# Altium schematic sheet powerswitch.SchDoc
size C
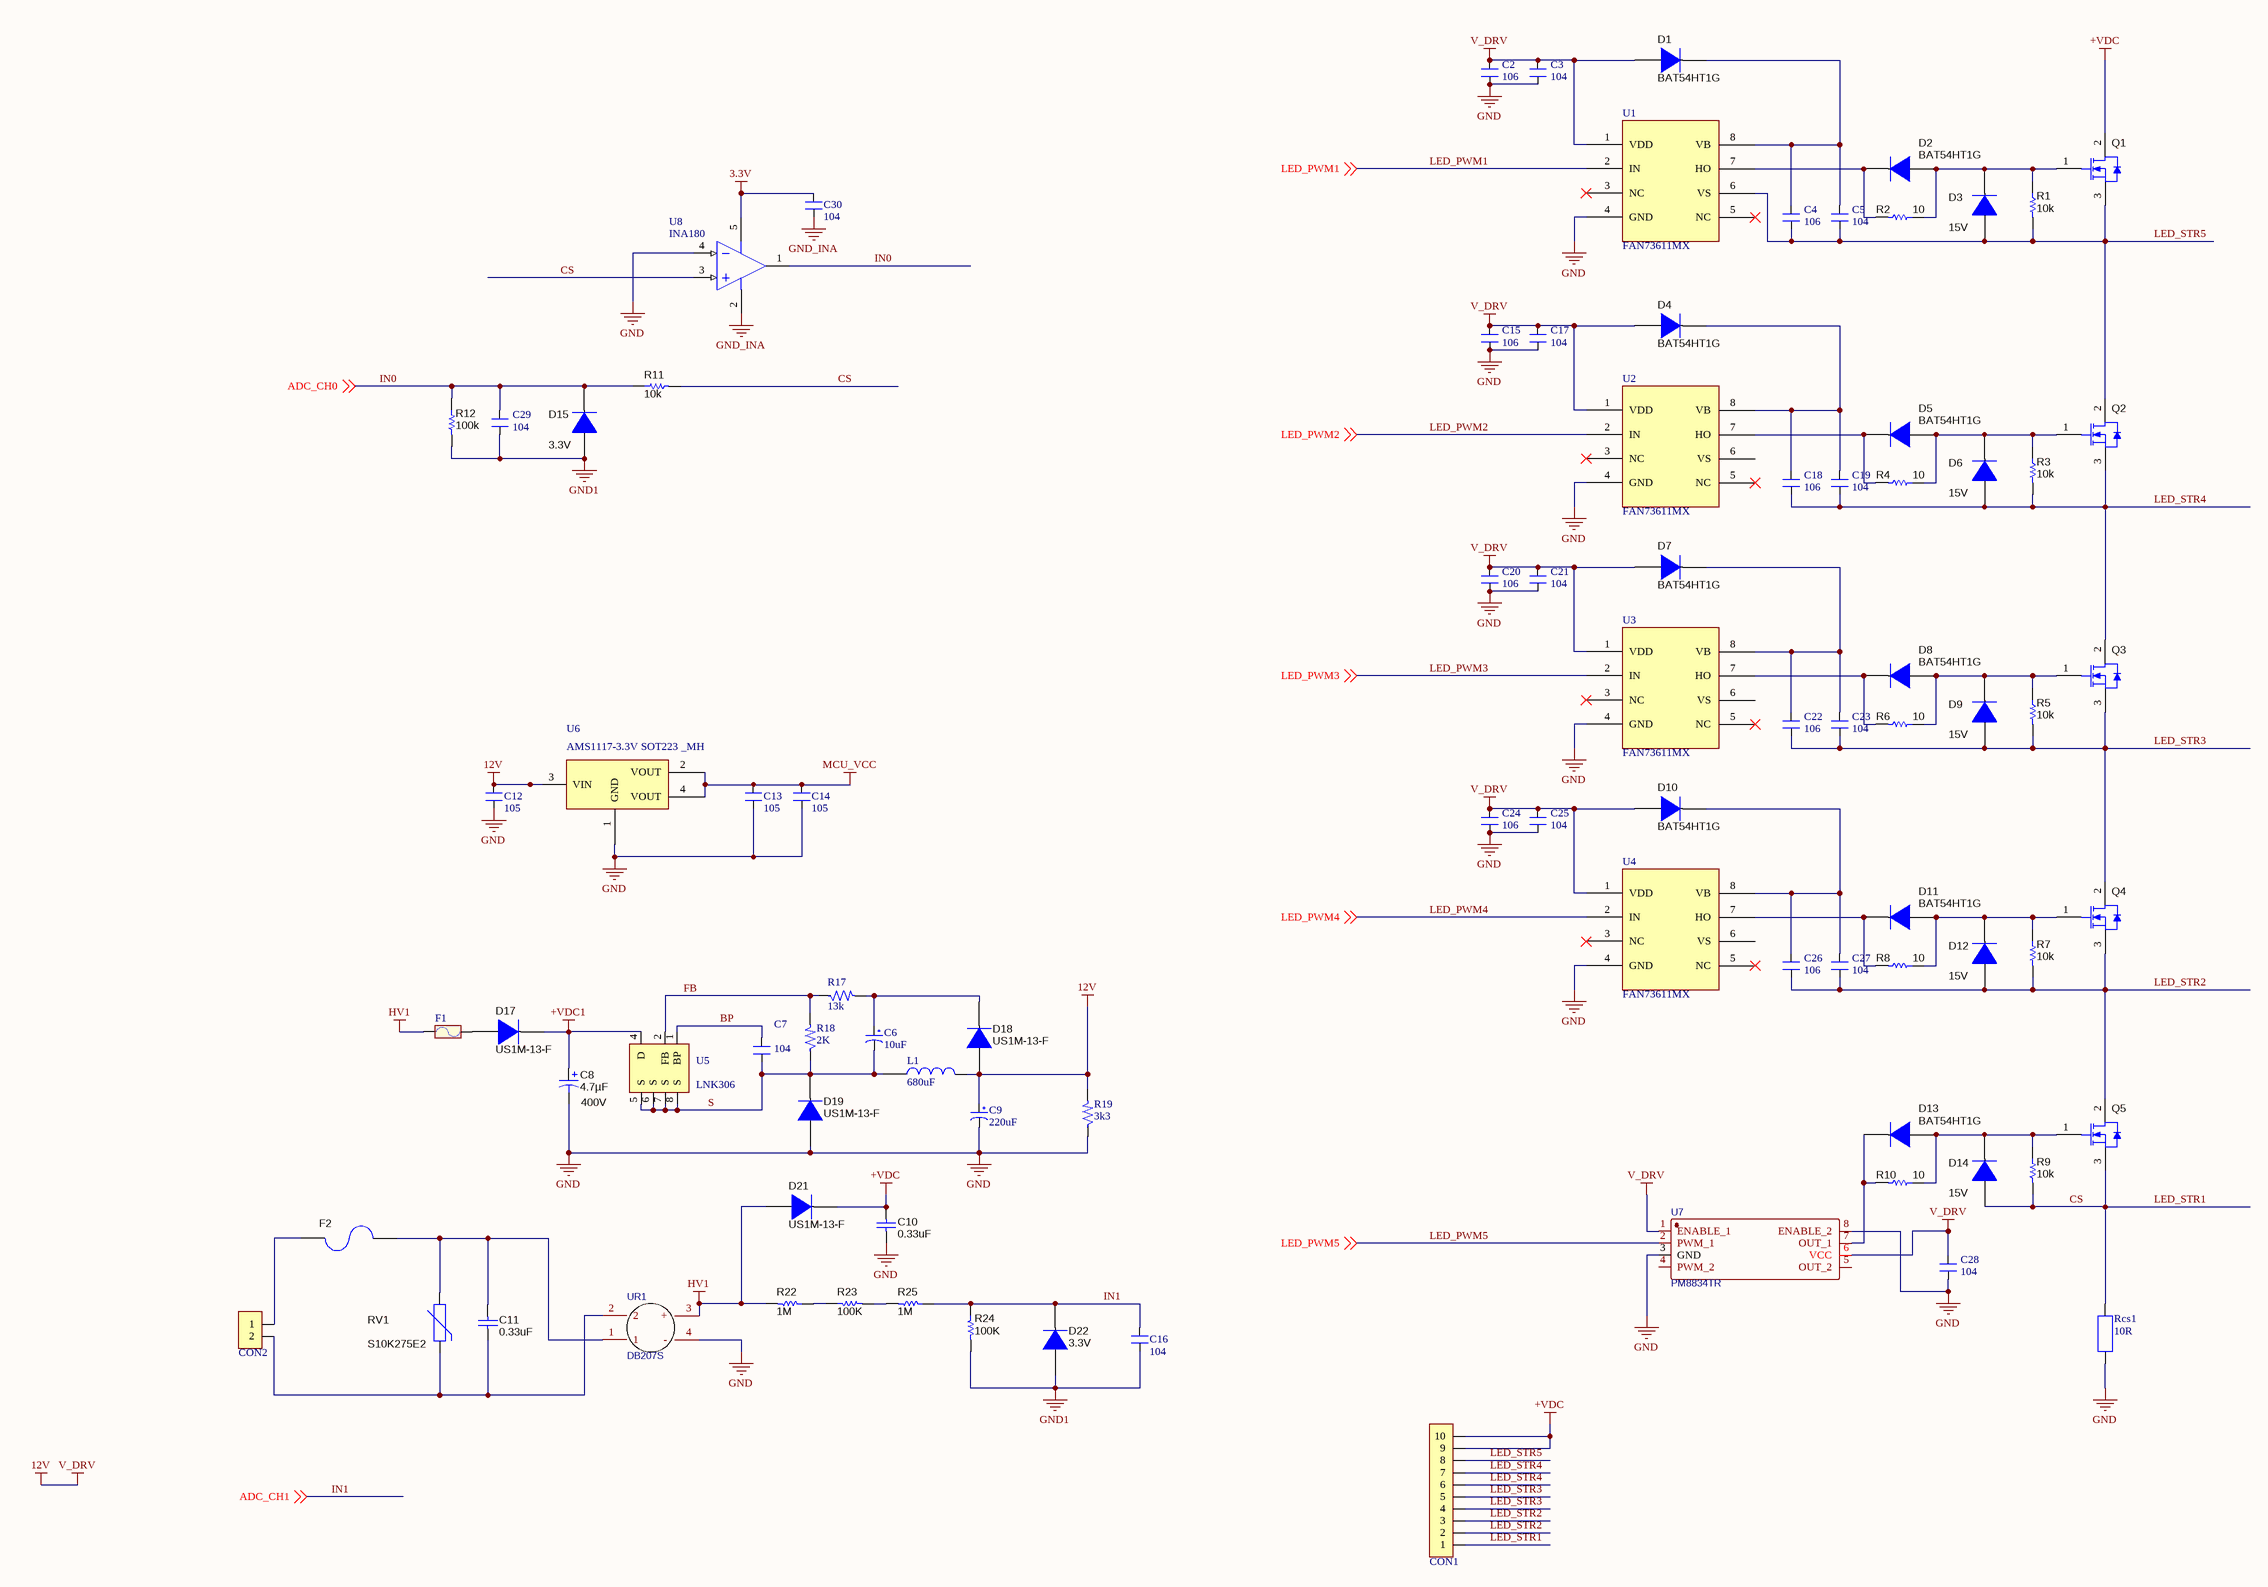
[diagram p0: powerswitch.SchDoc]

## Parts
C2  106  [0805_HV]
C3  104  [0805_HV]
C4  106  [0805_HV]
C5  104  [0805_HV]
C6  10uF  [TU_NHOM_10uF_MH]
C7  104  [0805_HV]
C8  ValueDisplayed: 4.7µF  Value2: 400V  [CAP-PANACAP-G-GENERIC]  (hidden comment: 400AX6R8M8x11)
C9  220uF  [TU_NHOM_2.5_MH]
C10  value 0.33uF  [B32922_12mm]  (hidden comment: B32922C3334M189)
C11  value 0.33uF  [B32922_12mm]  (hidden comment: B32922C3334M189)
C12  105  [0805_HV]
C13  105  [0805_HV]
C14  105  [0805_HV]
C15  106  [0805_HV]
C16  104  [0805_HV]
C17  104  [0805_HV]
C18  106  [0805_HV]
C19  104  [0805_HV]
C20  106  [0805_HV]
C21  104  [0805_HV]
C22  106  [0805_HV]
C23  104  [0805_HV]
C24  106  [0805_HV]
C25  104  [0805_HV]
C26  106  [0805_HV]
C27  104  [0805_HV]
C28  104  [0805_HV]
C29  104  [0805_HV]
C30  104  [0805_HV]
CON1  CON 10 EDG 5.08_MH  [Con 10 EDG 5.08]  (value not drawn)
CON2  CON 2 EDG 5.08_MH  [CON 2 EDG 5.08]  (value not drawn)
D1  BAT54HT1G  [SOD-323]
D2  BAT54HT1G  [SOD-323]
D3  15V  [SOD-323]
D4  BAT54HT1G  [SOD-323]
D5  BAT54HT1G  [SOD-323]
D6  15V  [SOD-323]
D7  BAT54HT1G  [SOD-323]
D8  BAT54HT1G  [SOD-323]
D9  15V  [SOD-323]
D10  BAT54HT1G  [SOD-323]
D11  BAT54HT1G  [SOD-323]
D12  15V  [SOD-323]
D13  BAT54HT1G  [SOD-323]
D14  15V  [SOD-323]
D15  3.3V  [SOD-323]
D17  US1M-13-F  [SMB]
D18  US1M-13-F  [SMB]
D19  US1M-13-F  [SMB]
D21  US1M-13-F  [SMB]
D22  3.3V  [SOD-323]
F1  FUSE_AUTO_0.5A 8V 1206_MH  [FUSE 1206]  (value not drawn)
F2  37015000430  [Fuse 5x20]  (value not drawn)
L1  680uF  [Inductor 4.5x5]
Q1  IPA60R330P  [TO-220AB_NH]  (value not drawn)
Q2  IPA60R330P  [TO-220AB_NH]  (value not drawn)
Q3  IPA60R330P  [TO-220AB_NH]  (value not drawn)
Q4  IPA60R330P  [TO-220AB_NH]  (value not drawn)
Q5  IPA60R330P  [TO-220AB_NH]  (value not drawn)
R1  10k  [Tro SMD 0805]
R2  10  [Tro SMD 0805]
R3  10k  [Tro SMD 0805]
R4  10  [Tro SMD 0805]
R5  10k  [Tro SMD 0805]
R6  10  [Tro SMD 0805]
R7  10k  [Tro SMD 0805]
R8  10  [Tro SMD 0805]
R9  10k  [Tro SMD 0805]
R10  10  [Tro SMD 0805]
R11  10k  [Tro SMD 0805]
R12  100k  [Tro SMD 0805]
R17  13k  [0805_HV]
R18  2K  [0805_HV]
R19  3k3  [0805_HV]
R22  1M  [1206]
R23  100K  [1206]
R24  100K  [1206]
R25  1M  [1206]
Rcs1  10R  [TRO_VACH_2W]
RV1  S10K275E2  [VAR_S10K275E2]
U1  FAN73611MX  [SOP 8]
U2  FAN73611MX  [SOP 8]
U3  FAN73611MX  [SOP 8]
U4  FAN73611MX  [SOP 8]
U5  LNK306  [SOP 7]
U6  AMS1117-3.3V SOT223 _MH  [SOT223]
U7  PM8834TR  [SOP 8]
U8  INA180  [SOT23-5AL]
UR1  DB207S  [DB207S]

## Nets
3.3V: C30.2 U8.5(V+)
12V: C2.2 C3.2 C9.1 C12.2 C15.2 C17.2 C20.2 C21.2 C24.2 C25.2 C28.2 D1.2(A) D4.2(A) D7.2(A) D10.2(A) D18.2(A) L1.2 R19.2 U1.1(VDD) U2.1(VDD) U3.1(VDD) U4.1(VDD) U6.3(VIN) U7.1(ENABLE_1) U7.6(VCC)  [also labelled V_DRV]
+VDC: C10.2 CON1.9 CON1.10 D21.1(K) Q1.2(D)
+VDC1: C8.1(+) D17.1(K) U5.4(D)
GND: C2.1 C3.1 C8.2(-) C9.2 C10.1 C12.1 C13.1 C14.1 C15.1 C17.1 C20.1 C21.1 C24.1 C25.1 C28.1 D19.2(A) R19.1 Rcs1.1 U1.4(GND) U2.4(GND) U3.4(GND) U4.4(GND) U6.1(GND) U7.3(GND) U7.8(ENABLE_2) U8.4(IN-) UR1.4(-)
GND1: C16.1 C29.1 D15.2(A) D22.2(A) R12.2 R24.2
GND_INA: C30.1 U8.2(V-)
HV1: D21.2(A) F1.1 R22.2 UR1.3(+)
MCU_VCC: C13.2 C14.2 U6.2(VOUT) U6.4(VOUT)
BP: C7.2 U5.1(BP)
CS: CON1.1 D14.2(A) Q5.3(S) R9.2 R11.2 Rcs1.2 U8.3(IN+)  [also labelled LED_STR1]
FB: R17.1 R18.2 U5.2(FB)
IN0: C29.2 D15.1(K) R11.1 R12.1 U8.1(OUT) ; off-sheet ADC_CH0  [also labelled ADC_CH0]
IN1: C16.2 D22.1(K) R24.1 R25.1 ; off-sheet ADC_CH1  [also labelled ADC_CH1]
LED_PWM1: U1.2(IN) ; off-sheet LED_PWM1
LED_PWM2: U2.2(IN) ; off-sheet LED_PWM2
LED_PWM3: U3.2(IN) ; off-sheet LED_PWM3
LED_PWM4: U4.2(IN) ; off-sheet LED_PWM4
LED_PWM5: U7.2(PWM_1) ; off-sheet LED_PWM5
LED_STR2: C26.1 C27.1 CON1.2 CON1.3 D12.2(A) Q4.3(S) Q5.2(D) R7.2
LED_STR3: C22.1 C23.1 CON1.4 CON1.5 D9.2(A) Q3.3(S) Q4.2(D) R5.2
LED_STR4: C18.1 C19.1 CON1.6 CON1.7 D6.2(A) Q2.3(S) Q3.2(D) R3.2
LED_STR5: C4.1 C5.1 CON1.8 D3.2(A) Q1.3(S) Q2.2(D) R1.2 U1.6(VS)
S: C6.2 C7.1 D19.1(K) L1.1 R18.1 U5.5(S) U5.6(S) U5.7(S) U5.8(S)
NetC4_2: C4.2 C5.2 D1.1(K) U1.8(VB)
NetC6_1: C6.1 D18.1(K) R17.2
NetC11_1: C11.1 CON2.2 RV1.2 UR1.2
NetC11_2: C11.2 F2.1 RV1.1 UR1.1
NetC18_2: C18.2 C19.2 D4.1(K) U2.8(VB)
NetC22_2: C22.2 C23.2 D7.1(K) U3.8(VB)
NetC26_2: C26.2 C27.2 D10.1(K) U4.8(VB)
NetCON2_1: CON2.1 F2.2
NetD2_1: D2.1(K) R2.2 U1.7(HO)
NetD2_2: D2.2(A) D3.1(K) Q1.1(G) R1.1 R2.1
NetD5_1: D5.1(K) R4.2 U2.7(HO)
NetD5_2: D5.2(A) D6.1(K) Q2.1(G) R3.1 R4.1
NetD8_1: D8.1(K) R6.2 U3.7(HO)
NetD8_2: D8.2(A) D9.1(K) Q3.1(G) R5.1 R6.1
NetD11_1: D11.1(K) R8.2 U4.7(HO)
NetD11_2: D11.2(A) D12.1(K) Q4.1(G) R7.1 R8.1
NetD13_1: D13.1(K) R10.2 U7.7(OUT_1)
NetD13_2: D13.2(A) D14.1(K) Q5.1(G) R9.1 R10.1
NetD17_2: D17.2(A) F1.2
NetR22_1: R22.1 R23.1
NetR23_2: R23.2 R25.2

Not connected (* = marked no-connect by the designer): U1 3(NC)* 5(NC)*; U2 3(NC)* 5(NC)* 6(VS); U3 3(NC)* 5(NC)* 6(VS); U4 3(NC)* 5(NC)* 6(VS); U7 4(PWM_2) 5(OUT_2)

## Library data of the parts
C2-C5 C7 C12-C30 = CM: Cap SMD; Value: 103
C6 = TU_NHOM_10uF_25V_MH: Value: 47uF/16 - 50V; Description 1: 470uF/6,3V - 330uF/10V - 220uF/16V; Description 2: 100uF/25V - 35V - 47uF/50V - 22uF/100V; Description 3: 33uF => 47uF/63V - 1uF => 4,7uF/160V; Description 4: 1uF => 2,2uF/250V - 1uF/350V
C8 = 400AX6R8M8x11: CAP, AL, 6.8uF, 400V, +/-20%, TH; Manufacturer: Rubycon; Polarized: Y; CompType: Capacitor; U/M: EA; Cap_F: 0.0000068; Tolerance_%: 20; Value1: Unknown; VDC_V: 400; TaMin_C: -40; TaMax_C: 105; Cap_Case: 8x11; SymbolVersion: 2008-07-09; Value: 6.8uF; PartNumber: 400AX6R8M8x11; PackageReference: 8x11; RoHS: Y; MountType: TH; Technology: AL; Series: AX; Publisher: Texas Instruments; LatestRevisionDate: 2013-08-02; ComponentLink1Description: Datasheet link; ComponentLink1URL: http://www.rubycon.co.jp/de/catalog/e_pdfs/aluminum/e_ax.pdf
C9 = TU_NHOM_220uF_25V_MH: LINK: https://item.taobao.com/item.htm?spm=a230r.1.14.282.6c612953FsebRk&id=546158429968&ns=1&abbucket=10#detail
C10 C11 = BFC233620154: CAP FILM 0.33UF 630VDC RADIAL; Manufacturer: EPCOS(TDK); CompType: Film Capacitor; SymbolCreator: x0199378; PartNumber: B32922C3334M189; RoHS: Y; MountType: TH; ComponentLink1Description: Datasheet link; ComponentLink1URL: http://en.tdk.eu/inf/20/20/db/fc_2009/X2_B32921_928.pdf; SymbolVersion: 2015-01-29
CON1 = CON 10 EDG 5.08_MH: CON 10 EDG 5.08 (xanh cong)
CON2 = CON 2 EDG 5.08_MH: CON 2 EDG 5.08 (xanh cong)
D1 D2 D4 D5 D7 D8 D10 D11 D13 = MMDL914-TP: Diode, Switching, 100 V, 0.2 A, SOD-323; Manufacturer: Micro Commercial Components; U/M: EA; Vf_V: 1; Value: 100V; Value1: 0.2A; Value2: 1V; Io_A: 0.2; Vr_V: 100; TJmax_C: 150; SizeAreaWB_mm2: 8.695; SizeArea_mm2: 3.645; SizeX_mm: 2.7; SizeY_mm: 1.35; AEC Category: Q101; SymbolVersion: 2008-12-08; PartNumber: BAT54HT1G; PackageReference: SOD-323; CompType: Diode; MountType: SMT; Type: Switching; RoHS: Y; SizeZ_mm: 1; Published: 2008-06-26; Publisher: Texas Instruments; LatestRevisionDate: 2016-10-18; ComponentLink1Description: Datasheet link; ComponentLink1URL: http://www.mccsemi.com/up_pdf/MMDL914(SOD-323).pdf; Supplier 1: Digi-Key; Supplier Part Number 1: MMDL914-TPMSCT-ND; AEC Qualified: ?
D3 D6 D9 D12 D14 D15 D22 = MMDL914-TP: Diode, Switching, 100 V, 0.2 A, SOD-323; PartNumber: BAV21W-7-F; Manufacturer: Micro Commercial Components; U/M: EA; Vf_V: 1; Value: 100V; Value1: 0.2A; Value2: 1V; Io_A: 0.2; Vr_V: 100; TJmax_C: 150; SizeAreaWB_mm2: 8.695; SizeArea_mm2: 3.645; SizeX_mm: 2.7; SizeY_mm: 1.35; AEC Category: Q101; SymbolVersion: 2008-12-08; PackageReference: SOD-323; CompType: Diode; MountType: SMT; Type: Switching; RoHS: Y; SizeZ_mm: 1; Published: 2008-06-26; Publisher: Texas Instruments; LatestRevisionDate: 2016-10-18; ComponentLink1Description: Datasheet link; ComponentLink1URL: http://www.mccsemi.com/up_pdf/MMDL914(SOD-323).pdf; Supplier 1: Digi-Key; Supplier Part Number 1: MMDL914-TPMSCT-ND; AEC Qualified: ?
D17-D19 D21 = MURS160-13-F: Diode, Ultrafast, 600V, 1A, SMB; Manufacturer: Diodes Inc.; U/M: EA; Vf_V: 1.25; Value2: 1.25V; Io_A: 1; Vr_V: 600; TJmax_C: 150; RJC_CperW: 13; PartNumber: US1M-13-F; CompType: Diode; SymbolVersion: 2008-12-08; MountType: SMT; RoHS: Y; Value: 600V; PackageReference: SMB; Value1: 1A; Type: Ultrafast; Published: 2008-06-26; Publisher: Texas Instruments; LatestRevisionDate: 2013-06-21; ComponentLink1Description: Datasheet link; ComponentLink1URL: http://www.diodes.com/datasheets/ds30130.pdf; Supplier 1: Digi-Key; Supplier 2: Mouser; Supplier 3: Farnell
F1 = FUSE_AUTO_0.5A 8V 1206_MH: Fuse
F2 = 0216008.MXESPP: FUSE BOARD MOUNT 5A 250VAC RAD; Manufacturer: Littelfuse Inc; U/M: EA; VDC_V: 250; Irating_A: 5; Rtyp_Ohm: 0.0123; Soldering_Wave_MaxTemp_C: 260; SymbolVersion: 2008-07-09; PartNumber: 37015000430; PackageReference: Radial, Can, Vertical; CompType: Fuse; Published: 2009-03-05; RoHS: Y; VAC_V: 250; Publisher: Texas Instruments; LatestRevisionDate: 2014-04-17; ComponentLink1Description: Datasheet link; ComponentLink1URL: http://www.littelfuse.com/~/media/electronics/datasheets/fuses/littelfuse_fuse_370_datasheet.pdf.pdf; Soldering_Wave_MaxTime_s: 5; MountType: TH; Supplier 1: Digi-Key; Supplier Part Number 1: F4482-ND
L1 = Inductor 4.5x5_MH
Q1-Q5 = IPP60R190P6: MOSFET N-CH 600V 10.6A TO220; PartNumber: IPA60R330P6XKSA1; Manufacturer: Infineon Technologies; SymbolCreator: x0199378; SymbolVersion: 2015-04-01; CompType: MOSFET; Value: 600 V; RoHS: Y; MountType: TH; ComponentLink1Description: Datasheet link; ComponentLink1URL: http://www.infineon.com/dgdl/Infineon-IPX60R330P6-DS-v02_02-EN.pdf?fileId=db3a3043416e106e01416e6a5f240149; Supplier Part Number 1: IPA60R330P6XKSA1-ND; Supplier 1: Digikey; Part Used: IPA60R330P
R1-R12 R22-R25 = R nho: RES, 100, 1%, 0.1 W, 0402; PartNumber: ERJ-2RKF1000X; Manufacturer: Panasonic; CompType: Resistor; Res_ohm: 100; Value_Code: 100R; Tolerance_%: 1; Power_W: 0.1; Value2: 0.1W; VDC_V: 50; TempCo: 100 ppm/C; EIA_Code: E96; U/M: EA; AEC Category: Q200; SymbolVersion: 2009-05-29; PackageReference: 0402; RoHS: Y; Value1: 1%; MountType: SMT; Technology: Thick Film; Published: 2008-06-26; Publisher: Texas Instruments; LatestRevisionDate: 2016-01-08; ComponentLink1Description: Datasheet link; ComponentLink1URL: http://industrial.panasonic.com/www-data/pdf/AOA0000/AOA0000CE2.pdf; Supplier 1: Digi-Key; Supplier Part Number 1: P100LCT-ND; Supplier 2: Mouser; Supplier Part Number 2: 667-ERJ-2RKF1000X; Supplier 3: Farnell; Supplier Part Number 3: 2304034; AEC Qualified: ?
  R1 R3 R5 R7 R9 R11: Value: 10k
  R2 R4 R6 R8 R10: Value: 10
  R12: Value: 100k
  R22 R25: Value: 1M
  R23 R24: Value: 100K
R17-R19 = R: Resistor 1/4W; Value: R1/4W - 1K
Rcs1 = TRO_CS_2W_MH: Value: V?
RV1 = S10K275E2: Varistor 275V RMS 10MM Radial, TH; Manufacturer: EPCOS Inc; SymbolCreator: a0412235; SymbolVersion: 2012-06-04; PartNumber: S10K275E2; MountType: TH; ComponentLink1Description: Datasheet URL; ComponentLink1URL: http://www.epcos.com/inf/70/db/var_08/SIOV_Leaded_AdvanceD.pdf; RoHS: Y; PackageReference: 10mm Radial; Publisher: Texas Instruments; LatestRevisionDate: 2013-02-24; Supplier 1: Digi-Key; Supplier Part Number 1: 495-1433-ND
U5 = Component_1
U7 = PM8834TR: BOM_Manufacturer: STMicroelectronics; Contributor: LCSC; BOM_Supplier: LCSC; BOM_Supplier Part: C221495; BOM_Manufacturer Part: PM8834TR; spicePre: U
U8 = INA180: Micropower Quad CMOS Voltage Comparator
UR1 = DB207S: BOM_Manufacturer: DYELEC; SMT Type: Extend; BOM_Supplier: LCSC; BOM_Manufacturer Part: DB207S; image: //image.lceda.cn/szlcsc/C84160.jpg; BOM_Supplier Part: C84160; BOM_LCSC Assembly: Yes; spicePre: U